# Altium project Gyro_Single_Axis.PrjPcb (part 2 of 2)

## Sheet Digital_Supply_and_Connectors.SchDoc
size A3; SheetNumber: 4; SheetTotal: 4; SPICEModelCacheFOVJYOIP: <root> / <DocumentId>FOVJYOIP</DocumentId> / <CacheFrame Number="0"> / <Model Name="led0" Kind="MDL"> / <Text>*Typ INFRARED GaAs LED: Vf=1.2V Vr=5V If=40mA trr=3uS / *LED Pinout: 1=A, 2=K / .MODEL LED0 D (IS=93.5P RS=84M N=2.63 BV=5 IBV=10U / + CJO=2.97P VJ=.75 M=.333 TT=4.32U)</Text> / </Model> / </CacheFrame> / </root>
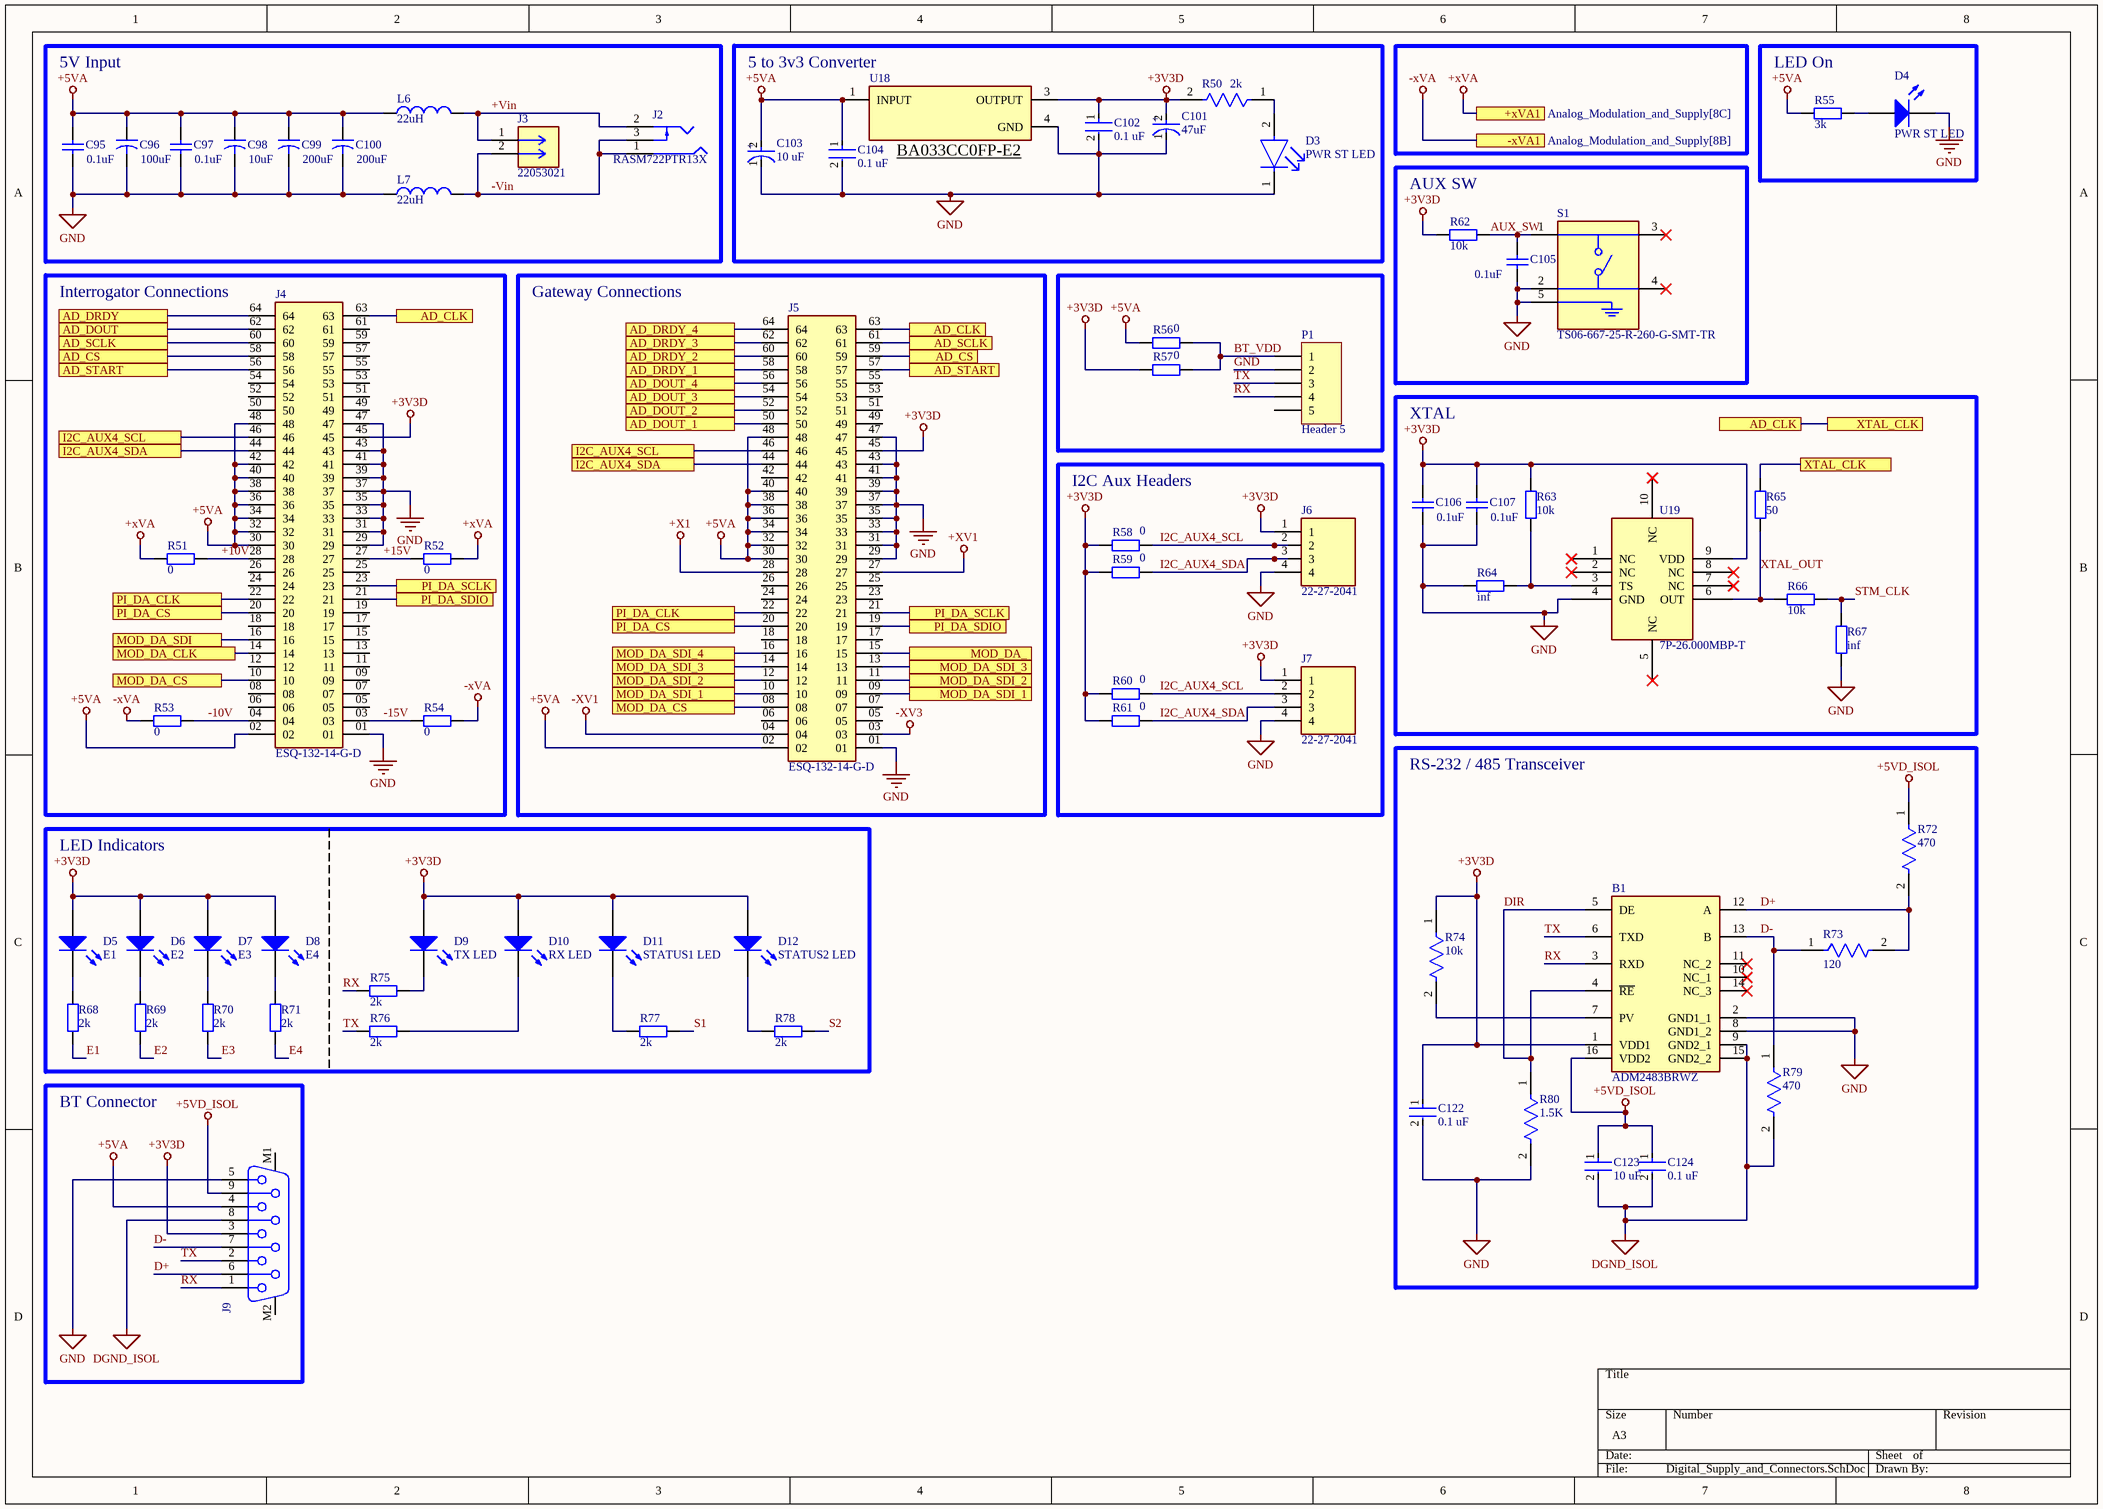
[diagram p3: Digital_Supply_and_Connectors.SchDoc]

### Parts
B1  ADM2483BRWZ  [ADM2483BRWZ]
C95  value 0.1uF  [RAD-0.3]  (hidden comment: Cap)
C96  value 100uF  [CAPR5-4X5]  (hidden comment: Cap2)
C97  value 0.1uF  [RAD-0.3]  (hidden comment: Cap)
C98  value 10uF  [CAPR5-4X5]  (hidden comment: Cap2)
C99  value 200uF  [CAPR5-4X5]  (hidden comment: Cap2)
C100  value 200uF  [CAPR5-4X5]  (hidden comment: Cap2)
C101  47uF  [FP-TAJR-MFG]
C102  0.1 uF  [FP-CC0805-0_85-MFG]
C103  10 uF  [FP-TAJR-MFG]
C104  0.1 uF  [FP-CC0805-0_85-MFG]
C105  value 0.1uF  [RAD-0.3]  (hidden comment: Cap)
C106  value 0.1uF  [RAD-0.3]  (hidden comment: Cap)
C107  value 0.1uF  [RAD-0.3]  (hidden comment: Cap)
C122  0.1 uF  [FP-CC0805-0_85-MFG]
C123  10 uF  [FP-0805-L_2_01_0_2-W_1_25-MFG]
C124  0.1 uF  [FP-CC0805-0_85-MFG]
D3  PWR ST LED  [FP-APHCM2012SYCK-F01-MFG]
D4  PWR ST LED  [LED-0]
D5  E1  [LED-0]
D6  E2  [LED-0]
D7  E3  [LED-0]
D8  E4  [LED-0]
D9  TX LED  [LED-0]
D10  RX LED  [LED-0]
D11  STATUS1 LED  [LED-0]
D12  STATUS2 LED  [LED-0]
J2  RASM722PTR13X  [RASM722PTR13X]
J3  22053021  [22-05-3021]
J4  ESQ-132-14-G-D  [ESQ-132-14-G-D]
J5  ESQ-132-14-G-D  [ESQ-132-14-G-D]
J6  22-27-2041  [22-27-2041]
J7  22-27-2041  [22-27-2041]
J9  618009231121  [618009231121]  (value not drawn)
L6  value 22uH  [0402-A]  (hidden comment: Inductor)
L7  value 22uH  [0402-A]  (hidden comment: Inductor)
P1  Header 5  [HDR1X5]
R50  2k  [FP-RR1220-MFG]
R51  value 0  [AXIAL-0.4]  (hidden comment: Res2)
R52  value 0  [AXIAL-0.4]  (hidden comment: Res2)
R53  value 0  [AXIAL-0.4]  (hidden comment: Res2)
R54  value 0  [AXIAL-0.4]  (hidden comment: Res2)
R55  value 3k  [AXIAL-0.4]  (hidden comment: Res2)
R56  value 0  [AXIAL-0.4]  (hidden comment: Res2)
R57  value 0  [AXIAL-0.4]  (hidden comment: Res2)
R58  value 0  [AXIAL-0.4]  (hidden comment: Res2)
R59  value 0  [AXIAL-0.4]  (hidden comment: Res2)
R60  value 0  [AXIAL-0.4]  (hidden comment: Res2)
R61  value 0  [AXIAL-0.4]  (hidden comment: Res2)
R62  value 10k  [AXIAL-0.4]  (hidden comment: Res2)
R63  value 10k  [AXIAL-0.4]  (hidden comment: Res2)
R64  value inf  [AXIAL-0.4]  (hidden comment: Res2)
R65  value 50  [AXIAL-0.4]  (hidden comment: Res2)
R66  value 10k  [AXIAL-0.4]  (hidden comment: Res2)
R67  value inf  [AXIAL-0.4]  (hidden comment: Res2)
R68  value 2k  [AXIAL-0.4]  (hidden comment: Res2)
R69  value 2k  [AXIAL-0.4]  (hidden comment: Res2)
R70  value 2k  [AXIAL-0.4]  (hidden comment: Res2)
R71  value 2k  [AXIAL-0.4]  (hidden comment: Res2)
R72  470  [FP-RR1220-MFG]
R73  120  [FP-RR1220-MFG]
R74  10k  [FP-RR1220-MFG]
R75  value 2k  [AXIAL-0.4]  (hidden comment: Res2)
R76  value 2k  [AXIAL-0.4]  (hidden comment: Res2)
R77  value 2k  [AXIAL-0.4]  (hidden comment: Res2)
R78  value 2k  [AXIAL-0.4]  (hidden comment: Res2)
R79  470  [FP-RR1220-MFG]
R80  1.5K  [FP-RR1220-MFG]
S1  TS06-667-25-R-260-G-SMT-TR  [TS06-667-25-R-260-G-SMT-TR]
U18  TLV2217-33KVURG3  [FP-KVU0003A-MFG]  (value not drawn)
U19  7P-26.000MBP-T  [7P26000MBPT]

### Blocks framed on the sheet
5V Input: C95-C100 J2 J3 L6 L7
LED On: D4 R55
AUX SW: C105 R62 S1
Interrogator Connections: J4 R51-R54
Gateway Connections: J5
XTAL: C106 C107 R63-R67 U19
I2C Aux Headers: J6 J7 R58-R61
RS-232 / 485 Transceiver: B1 C122-C124 R72-R74 R79 R80
LED Indicators: D5-D12 R68-R71 R75-R78
BT Connector: J9

### Ports
+xVA1 (see Analog_Modulation_and_Supply[8C]), -xVA1 (see Analog_Modulation_and_Supply[8B]), AD_CLK (see Analog_Acquisition_Circuit[5C], Digital_STMG447RET6[5B], Digital_Supply_and_Connectors[2A], Digital_Supply_and_Connectors[4A]), AD_CLK (see Analog_Acquisition_Circuit[5C], Digital_STMG447RET6[5B], Digital_Supply_and_Connectors[2A], Digital_Supply_and_Connectors[7B]), AD_CLK (see Analog_Acquisition_Circuit[5C], Digital_STMG447RET6[5B], Digital_Supply_and_Connectors[4A], Digital_Supply_and_Connectors[7B]), AD_CS (see Analog_Acquisition_Circuit[3C], Digital_STMG447RET6[2B], Digital_Supply_and_Connectors[1A]), AD_CS (see Analog_Acquisition_Circuit[3C], Digital_STMG447RET6[2B], Digital_Supply_and_Connectors[4A]), AD_DOUT (see Analog_Acquisition_Circuit[4C], Digital_STMG447RET6[5B]), AD_DOUT_1, AD_DOUT_2, AD_DOUT_3, AD_DOUT_4, AD_DRDY (see Analog_Acquisition_Circuit[4C], Digital_STMG447RET6[2B]), AD_DRDY_1, AD_DRDY_2, AD_DRDY_3, AD_DRDY_4, AD_SCLK (see Analog_Acquisition_Circuit[5C], Digital_STMG447RET6[5B], Digital_Supply_and_Connectors[1A]), AD_SCLK (see Analog_Acquisition_Circuit[5C], Digital_STMG447RET6[5B], Digital_Supply_and_Connectors[4A]), AD_START (see Analog_Acquisition_Circuit[3C], Digital_STMG447RET6[3B], Digital_Supply_and_Connectors[1A]), AD_START (see Analog_Acquisition_Circuit[3C], Digital_STMG447RET6[3B], Digital_Supply_and_Connectors[4A]), I2C_AUX4_SCL (see Digital_Supply_and_Connectors[1B]), I2C_AUX4_SCL (see Digital_Supply_and_Connectors[3B]), I2C_AUX4_SDA (see Digital_Supply_and_Connectors[1B]), I2C_AUX4_SDA (see Digital_Supply_and_Connectors[3B]), MOD_DA_, MOD_DA_CLK (see Analog_Modulation_and_Supply[5A], Digital_STMG447RET6[3B]), MOD_DA_CS (see Analog_Modulation_and_Supply[5A], Digital_STMG447RET6[2B], Digital_Supply_and_Connectors[1B]), MOD_DA_CS (see Analog_Modulation_and_Supply[5A], Digital_STMG447RET6[2B], Digital_Supply_and_Connectors[3B]), MOD_DA_SDI (see Analog_Modulation_and_Supply[5A], Digital_STMG447RET6[3B]), MOD_DA_SDI_1 (see Digital_Supply_and_Connectors[3B]), MOD_DA_SDI_1 (see Digital_Supply_and_Connectors[4B]), MOD_DA_SDI_2 (see Digital_Supply_and_Connectors[3B]), MOD_DA_SDI_2 (see Digital_Supply_and_Connectors[4B]), MOD_DA_SDI_3 (see Digital_Supply_and_Connectors[3B]), MOD_DA_SDI_3 (see Digital_Supply_and_Connectors[4B]), MOD_DA_SDI_4, PI_DA_CLK (see Analog_Modulation_and_Supply[1A], Digital_STMG447RET6[3B], Digital_Supply_and_Connectors[1B]), PI_DA_CLK (see Analog_Modulation_and_Supply[1A], Digital_STMG447RET6[3B], Digital_Supply_and_Connectors[3B]), PI_DA_CS (see Analog_Modulation_and_Supply[1A], Digital_STMG447RET6[3B], Digital_Supply_and_Connectors[1B]), PI_DA_CS (see Analog_Modulation_and_Supply[1A], Digital_STMG447RET6[3B], Digital_Supply_and_Connectors[3B]), PI_DA_SCLK (see Analog_Modulation_and_Supply[1A], Digital_STMG447RET6[5B], Digital_Supply_and_Connectors[2B]), PI_DA_SCLK (see Analog_Modulation_and_Supply[1A], Digital_STMG447RET6[5B], Digital_Supply_and_Connectors[4B]), PI_DA_SDIO (see Analog_Modulation_and_Supply[1A], Digital_STMG447RET6[3B], Digital_Supply_and_Connectors[2B]), PI_DA_SDIO (see Analog_Modulation_and_Supply[1A], Digital_STMG447RET6[3B], Digital_Supply_and_Connectors[4B]), XTAL_CLK (see Digital_Supply_and_Connectors[7B])

### Nets
+3V3D: B1.1(VDD1) C101.2(A) C102.1 C106.2 C107.2 C122.1 D5.1(A) D6.1(A) D7.1(A) D8.1(A) D9.1(A) D10.1(A) D11.1(A) D12.1(A) J4.45 J5.45 J6.1 J7.1 J9.3 R50.2 R57.1 R58.1 R59.1 R60.1 R61.1 R62.1 R63.2 R74.1 U18.3(OUTPUT) U19.9(VDD)  [project net VDD1]
+5VD_ISOL: B1.16(VDD2) C123.1 C124.1 J9.9 R72.1
+X1: J5.28
+XV1: J5.27
+xVA: R51.1 R52.2 ; port +xVA1
-XV1: J5.04
-XV3: J5.03
DGND_ISOL: B1.9(GND2_1) B1.15(GND2_2) C123.2 C124.2 J9.8 R79.2
GND: B1.2(GND1_1) B1.8(GND1_2) C95.1 C95.2 C96.1 C96.2 C97.1 C97.2 C98.1 C98.2 C99.1 C99.2 C100.1 C100.2 C101.1(C) C102.2 C103.1(C) C103.2(A) C104.1 C104.2 C105.1 C106.1 C107.1 C122.2 D3.1(C) D4.2(K) J4.01 J4.02 J4.29 J4.30 J4.31 J4.32 J4.33 J4.34 J4.35 J4.36 J4.37 J4.38 J4.39 J4.40 J4.41 J4.42 J4.43 J4.47 J4.48 J5.01 J5.02 J5.29 J5.30 J5.31 J5.32 J5.33 J5.34 J5.35 J5.36 J5.37 J5.38 J5.39 J5.40 J5.41 J5.43 J5.47 J5.48 J6.4 J7.4 J9.4 J9.5 L6.1 L7.1 P1.2 R53.1 R54.2 R55.2 R56.1 R64.1 R67.2 R80.2 S1.2 S1.5 U18.1(INPUT) U18.4(GND) U19.4(GND) ; port -xVA1  [also labelled +5VA, -xVA]
+10V: J4.28 R51.2
+15V: J4.27 R52.1
+Vin: J2.2(SLEEVE) J3.1 L6.2
-10V: J4.04 R53.2
-15V: J4.03 R54.1
-Vin: J2.1(TIP) J2.3(SHUNT) J3.2 L7.2
AUX_SW: C105.2 R62.2 S1.1
BT_VDD: P1.1 R56.2 R57.2
D+: B1.12(A) J9.6 R72.2 R73.2
D-: B1.13(B) J9.7 R73.1 R79.1
DIR: B1.4(~{RE}) B1.5(DE) R80.1
E1: R68.1
E2: R69.1
E3: R70.1
E4: R71.1
I2C_AUX4_SCL: J6.2 J7.2 R58.2 R60.2
I2C_AUX4_SDA: J6.3 J7.3 R59.2 R61.2
RX: B1.3(RXD) J9.1 P1.4 R75.2
S1: R77.1
S2: R78.1
STM_CLK: R66.1 R67.1
TX: B1.6(TXD) J9.2 P1.3 R76.2
XTAL_OUT: R65.1 R66.2 U19.6(OUT)
NetB1_7: B1.7(PV) R74.2
NetC57_1: J4.22 J5.22 ; port PI_DA_CLK
NetD3_2: D3.2(A) R50.1
NetD4_1: D4.1(A) R55.1
NetD5_2: D5.2(K) R68.2
NetD6_2: D6.2(K) R69.2
NetD7_2: D7.2(K) R70.2
NetD8_2: D8.2(K) R71.2
NetD9_2: D9.2(K) R75.1
NetD10_2: D10.2(K) R76.1
NetD11_2: D11.2(K) R77.2
NetD12_2: D12.2(K) R78.2
NetJ4_10: J4.10 J5.08 ; port MOD_DA_CS
NetJ4_14: J4.14 ; port MOD_DA_CLK
NetJ4_16: J4.16 ; port MOD_DA_SDI
NetJ4_20: J4.20 J5.20 ; port PI_DA_CS
NetJ4_21: J4.21 J5.19 ; port PI_DA_SDIO
NetJ4_23: J4.23 J5.21 ; port PI_DA_SCLK
NetJ4_44: J4.44 J5.44 ; port I2C_AUX4_SDA
NetJ4_46: J4.46 J5.46 ; port I2C_AUX4_SCL
NetJ4_56: J4.56 J5.57 ; port AD_START
NetJ4_58: J4.58 J5.59 ; port AD_CS
NetJ4_60: J4.60 J5.61 ; port AD_SCLK
NetJ4_62: J4.62 ; port AD_DOUT
NetJ4_63: J4.63 J5.63 R65.2 ; port AD_CLK, port XTAL_CLK
NetJ4_64: J4.64 ; port AD_DRDY
NetJ5_09: J5.09 J5.10 ; port MOD_DA_SDI_1
NetJ5_11: J5.11 J5.12 ; port MOD_DA_SDI_2
NetJ5_13: J5.13 J5.14 ; port MOD_DA_SDI_3
NetJ5_15: J5.15 ; port MOD_DA_
NetJ5_16: J5.16 ; port MOD_DA_SDI_4
NetJ5_50: J5.50 ; port AD_DOUT_1
NetJ5_52: J5.52 ; port AD_DOUT_2
NetJ5_54: J5.54 ; port AD_DOUT_3
NetJ5_56: J5.56 ; port AD_DOUT_4
NetJ5_58: J5.58 ; port AD_DRDY_1
NetJ5_60: J5.60 ; port AD_DRDY_2
NetJ5_62: J5.62 ; port AD_DRDY_3
NetJ5_64: J5.64 ; port AD_DRDY_4
NetR63_1: R63.1 R64.2 U19.3(TS)

Not connected (* = marked no-connect by the designer): B1 10(NC_1)* 11(NC_2)* 14(NC_3)*; J4 05 06 07 08 09 11 12 13 15 17 18 19 24 25 26 49 50 51 52 53 54 55 57 59 61; J5 05 06 07 17 18 23 24 25 26 42 49 51 53 55; J9 M1 M2; P1 5; S1 3* 4*; U19 1(NC)* 2(NC)* 5(NC)* 7(NC)* 8(NC)* 10(NC)*

### Notes on the sheet
- (near U18) 5 to 3v3 Converter
- (near U18) BA033CC0FP-E2
- (in symbol CMP-2007-04030-2) +

### Library data of the parts
B1 = ADM2483BRWZ: Half-Duplex, iCoupler Isolated RS-485 Transceiver; Manufacturer_Name: Analog Devices; Geometry.Height: 2.65mm; Manufacturer_Part_Number: ADM2483BRWZ; Mouser Part Number: 584-ADM2483BRWZ; Mouser Price/Stock: https://www.mouser.co.uk/ProductDetail/Analog-Devices/ADM2483BRWZ?qs=BpaRKvA4VqH5Kim10agOlw%3D%3D; Arrow Part Number: ADM2483BRWZ; Arrow Price/Stock: https://www.arrow.com/en/products/adm2483brwz/analog-devices?utm_currency=USD&region=europe; Datasheet Link: http://uk.rs-online.com/web/p/products/0412719P
C95 C97 C105-C107 = Cap: Capacitor; Published: 8-Jun-2000; LatestRevisionDate: 17-Jul-2002; LatestRevisionNote: Re-released for DXP Platform.; PackageReference: RAD-0.3; Publisher: Altium Limited; PackageDescription: Radial Cap, Thru-Hole; 2 Leads; 0.3 in Pin Spacing
C96 C98-C100 = Cap2: Capacitor; Published: 23-Sep-2002; PackageReference: CAPR5-4X5; Publisher: Altium Limited; PackageDescription: Capacitor; 2 Leads
C101 C103 = CMP-2007-04030-2: 4.7uF 10V  ±10% 9Ω 0805  SMD Tantalum Capacitor; Dissipation Factor: 6%; ESR (Equivalent Series Resistance): 9R; Leakage Current: 500nA; Polarity: Polar; Lead Free: Lead Free; Min Operating Temperature: -55°C; Width: 1.3mm; Depth: 1.3mm; Case Code (Metric): 2012; Features: General Purpose; Length: 2.05mm; Package Quantity: 1; Tolerance: 10%; Height - Seated (Max): 0.047inch; REACH SVHC: No SVHC; Termination: SMD/SMT; Max Operating Temperature: 125°C; Mount: Surface Mount; Case/Package: 0805; Packaging: Tape and Reel; Case Code (Imperial): 0805; Voltage: 10V; Dielectric Material: Tantalum; Weight: 0.000194oz; Construction: Flat; Series: TAJ; Radiation Hardening: No; Voltage Rating: 10V; Height: 1.2mm; Capacitance: 4.7uF; RoHS Compliant: Yes
C102 C104 C122 C124 = CMP-1036-04410-2: CAP CER 0.1UF 25V X7R 0805; Manufacturer Part Number: CC0805KRX7R8BB104; Manufacturer: Yageo; Tolerance: 0.1; Material: Ceramic; Value: 100 nF; ComponentLink2URL: http://www.yageo.com/documents/recent/UPY-GPHC_Y5V_6.3V-to-50V_8.pdf; Category: Cap; Mouser Description: Multilayer Ceramic Capacitors MLCC - SMD/SMT 100nF 25V X7R 10%; Device Class L1: Passive Components; Footprint Url: http://www.yageo.com/exep/pages/download/literatures/UPY-C_GEN_24.pdf; Height: 0.95mm; Digikey Description: CAP CER 0.1UF 25V X7R 0805; Lead Free: Yes; Temperature Range High: +85°C; Temperature: -30°C to +85°C; Ipc Land Pattern Name: CAPC200125X85; Capacitance: 100 nF; Automotive: No; Octopart: https://octopart.com/cc0805krx7r8bb104-yageo-39467766; Device Class L2: Capacitors; Temperature Characteristic: X7R; Voltage Rating: 25 V; ComponentLink2Description: Datasheet; Temperature Range Low: -30°C; Device Class L3: Ceramic Capacitors; RoHS: TRUE; Package: CC0805-0.85
C123 = CMP-2007-04521-2: General Purpose Ceramic Capacitor, 0805, 10uF, 10%, X5R, 15%, 10V; Packaging: Tape and Reel; Mount: Surface Mount; Length: 2.01mm; Series: -; Dielectric Material: Ceramic; Voltage Rating: 10V; Tolerance: 10%; Voltage Rating (DC): 10V; Termination: SMD/SMT; Number of Pins: 2; Thickness: 0.055inch; Min Operating Temperature: -55°C; REACH SVHC: No SVHC; Width: 0.049inch; Case/Package: 0805; Capacitance: 10uF; Depth: 1.25mm; Height: 1.4mm; Voltage: 10V; Package Quantity: 3000; Lead Free: Lead Free; Case Code (Metric): 2012; Construction: Flat; RoHS Compliant: Yes; Case Code (Imperial): 0805; Dielectric: X5R; Max Operating Temperature: 85°C; Radiation Hardening: No
D3 = CMP-44529-000064-1: LED YELLOW CLEAR CHIP SMD; Number of LEDs: 1; Luminous Intensity: 150mcd; Dominant Wavelength: 590nm; Test Current: 20mA; Illumination Color: Green; Forward Voltage: 2V; Viewing Angle: 110°; Number of Pins: 2; Packaging: Tape and Reel; Width: 1.25mm; Height: 0.4mm; Lens Color: Clear; RoHS Compliant: Yes; Lead Free: Lead Free; Min Operating Temperature: -40°C; Case Code (Imperial): 0805; Case/Package: 0805; Series: APHCM; Wavelength: 590nm; Max Operating Temperature: 85°C; Length: 2mm; Color: Yellow; Package Quantity: 2000; Mount: Surface Mount; Lens Style: Clear; Forward Current: 20mA; Case Code (Metric): 2012
D4-D12 = LED0: Typical INFRARED GaAs LED; Published: 8-Jun-2000; LatestRevisionDate: 08-Jul-2005; LatestRevisionNote: Mech Layer 1 removed.; PackageReference: LED-0; Publisher: Altium Limited; PackageDescription: LED; 2 Leads
J2 = RASM722PTR13X: Power Barrel Connector Jack 2.10mm ID (0.083), 5.50mm OD (0.217) Surface Mount, Right Angle; MF: Switchcraft Inc.; SnapEDA_Link: https://www.snapeda.com/parts/RASM722PTR13X/SWITCHCRAFT/view-part/?ref=snap; Package: None; Value: *; MP: RASM722PTR13X; Check_prices: https://www.snapeda.com/parts/RASM722PTR13X/SWITCHCRAFT/view-part/?ref=eda
J4 J5 = ESQ-132-14-G-D: MF: Samtec; Availability: Unavailable; Price: None; Value: *; MP: ESQ-132-14-G-D; Package: None
J6 J7 = 22-27-2041: Headers & Wire Housings 4 POS HEADER; Manufacturer_Name: Molex; Geometry.Height: 11.7mm; Manufacturer_Part_Number: 22-27-2041; Mouser Part Number: 538-22-27-2041; Mouser Price/Stock: https://www.mouser.co.uk/ProductDetail/Molex/22-27-2041?qs=hSmm4fxMIuMKVUQkn4wbYQ%3D%3D; Arrow Part Number: *; Arrow Price/Stock: *; Datasheet Link: https://www.molex.com/pdm_docs/sd/022272041_sd.pdf
J9 = 618009231121: WR-DSUB 8.08mm Female PCB Connector with Hex Screw, THT, Angled, 9p; Manufacturer: Wurth Elektronik; Contact Resistance: 30mΩ; Rated Current: 3A; Working Voltage: 125VAC; Withstanding Voltage: 1000VAC; Manufacturer Part Number: 618009231121; Category: Input/Output Connector; Match Code: WR-DSUB; ComponentLink1Description: Website Link; ComponentLink1URL: https://www.we-online.com/redexpert/article/618009231121?ad; ComponentLink2Description: Datasheet Link; ComponentLink2URL: https://www.we-online.com/redexpert/spec/618009231121?ad; Mount: Through Hole; Min Operating Temperature: -55°C; Max Operating Temperature: 105°C; Packaging: Tray; Gender: Female; Number of Pins: 9; Orientation: Angled
L6 L7 = Inductor: Code_IEC: 1005; Published: 8-Jun-2000; LatestRevisionDate: 29-May-2009; LatestRevisionNote: IPC-7351 Footprint Added.; PackageReference: 0402-A; Publisher: Altium Limited; PackageDescription: Chip Inductor; Code_JEITA: 0402
P1 = Header 5: Header, 5-Pin; LatestRevisionDate: 17-Jul-2002; LatestRevisionNote: Re-released for DXP Platform.; Publisher: Altium Limited
R50 R72-R74 R79 R80 = CMP-2001-03560-2: 49.9Ω ±0.5% 0.1W 1/10W Chip Resistor 0805 (2012 Metric) Thin Film; Voltage Rating: 100V; Temperature Coefficient: 50ppm/°C; Max Power Dissipation: 100mW; Resistance: 49.9R; Packaging: Tape and Reel; Length: 0.079inch; Termination: SMD/SMT; Case Code (Metric): 2012; Voltage Rating (DC): 100V; Height: 0.02inch; Width: 0.049inch; RoHS Compliant: Yes; Tolerance: 0.5%; Case/Package: 0805; Resistance Tolerance: 0.5%; Lead Free: Lead Free; Size Code: 0805; Min Operating Temperature: -55°C; Max Operating Temperature: 125°C; Case Code (Imperial): 0805; Package Quantity: 1; Resistor Type: Thin Film; Number of Terminations: 2; Power Rating: 100mW; Series: RR
R51-R71 R75-R78 = Res2: Resistor; Published: 8-Jun-2000; LatestRevisionDate: 17-Jul-2002; LatestRevisionNote: Re-released for DXP Platform.; PackageReference: AXIAL-0.4; Publisher: Altium Limited; PackageDescription: Axial Device, Thru-Hole; 2 Leads; 0.4 in Pin Spacing
S1 = TS06-667-25-R-260-G-SMT-TR: 6 x 6.7 mm, 2.5 mm Actuator Height, 260 gf, Red, Surface Mount, SPST, Tactile Switch; MF: Same Sky; SnapEDA_Link: https://www.snapeda.com/parts/TS06-667-25-R-260-G-SMT-TR/Same+Sky/view-part/?ref=snap; Package: None; Value: *; MP: TS06-667-25-R-260-G-SMT-TR; Check_prices: https://www.snapeda.com/parts/TS06-667-25-R-260-G-SMT-TR/Same+Sky/view-part/?ref=eda
U18 = CMP-04917-000319-1: IC REG LINEAR 3.3V 500MA TO252-3; Number of Outputs: 1; Max Input Voltage: 12V; Min Input Voltage: 3V; Polarity: Positive; Dropout Voltage: 500mV; Output Type: Fixed; Output Voltage Accuracy: 1%; Quiescent Current: 290uA; Case/Package: TO-252; Radiation Hardening: No; Min Operating Temperature: 0°C; Output Current: 500mA; Package Quantity: 1; Packaging: Cut Tape; Mount: Surface Mount; Lead Free: Lead Free; RoHS Compliant: Yes; Contact Plating: Tin; Series: -; Nominal Output Voltage: 3.3V; Number of Pins: 3; REACH SVHC: No SVHC; Max Operating Temperature: 125°C; Number of Regulators: 1; Output Voltage: 3.3V; Input Bias Current: 290uA; Accuracy: 1%; Max Output Current: 500mA
J3 = 22053021: Package: None; Price: None; Value: *; MP: 22053021; Availability: Unavailable

## Nets that join several sheets
+3VD: Analog_Acquisition_Circuit (L1.1 L2.1 L3.1), Analog_Modulation_and_Supply (C84.1 U12.5)
+xVA: Analog_Modulation_and_Supply (R45.1 R46.1), Digital_Supply_and_Connectors (R51.1 R52.2)
GND: Analog_Acquisition_Circuit (102 pins), Analog_Modulation_and_Supply (75 pins), Digital_STMG447RET6 (18 pins), Digital_Supply_and_Connectors (82 pins)
VDD1: Digital_STMG447RET6 (11 pins), Digital_Supply_and_Connectors (30 pins)
NetC57_1: Analog_Modulation_and_Supply (C57.1 R27.2), Digital_STMG447RET6 (U20.20), Digital_Supply_and_Connectors (J4.22 J5.22)
NetJ4_10: Analog_Modulation_and_Supply (U9.8), Digital_Supply_and_Connectors (J4.10 J5.08)
NetJ4_14: Analog_Modulation_and_Supply (R33.1), Digital_STMG447RET6 (U20.19), Digital_Supply_and_Connectors (J4.14)
NetJ4_16: Analog_Modulation_and_Supply (R32.1), Digital_STMG447RET6 (U20.21), Digital_Supply_and_Connectors (J4.16)
NetJ4_20: Analog_Modulation_and_Supply (R24.2), Digital_STMG447RET6 (U20.45), Digital_Supply_and_Connectors (J4.20 J5.20)
NetJ4_21: Analog_Modulation_and_Supply (R25.2), Digital_STMG447RET6 (U20.58), Digital_Supply_and_Connectors (J4.21 J5.19)
NetJ4_23: Analog_Modulation_and_Supply (R26.2), Digital_STMG447RET6 (U20.52), Digital_Supply_and_Connectors (J4.23 J5.21)
NetJ4_56: Analog_Acquisition_Circuit (R9.1), Digital_STMG447RET6 (U20.30), Digital_Supply_and_Connectors (J4.56 J5.57)
NetJ4_58: Analog_Acquisition_Circuit (R10.1), Digital_Supply_and_Connectors (J4.58 J5.59)
NetJ4_60: Analog_Acquisition_Circuit (R21.1), Digital_STMG447RET6 (U20.35), Digital_Supply_and_Connectors (J4.60 J5.61)
NetJ4_62: Analog_Acquisition_Circuit (U5.44), Digital_STMG447RET6 (U20.36), Digital_Supply_and_Connectors (J4.62)
NetJ4_63: Analog_Acquisition_Circuit (U5.55), Digital_STMG447RET6 (U20.8), Digital_Supply_and_Connectors (J4.63 J5.63 R65.2)
NetJ4_64: Analog_Acquisition_Circuit (U5.46), Digital_Supply_and_Connectors (J4.64)